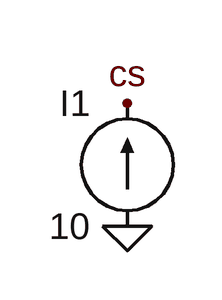
[diagram p0: schematic current_source.asc]
current_source.asc, the LTspice schematic file:
Version 4
SHEET 1 880 680
FLAG 96 192 0
FLAG 96 112 cs
SYMBOL current 96 192 R180
WINDOW 0 24 80 Left 2
WINDOW 3 24 0 Left 2
WINDOW 123 0 0 Left 2
WINDOW 39 0 0 Left 2
SYMATTR InstName I1
SYMATTR Value 10

The netlist it stands for:
* current_source.asc
I1 0 cs 10
.backanno
.end